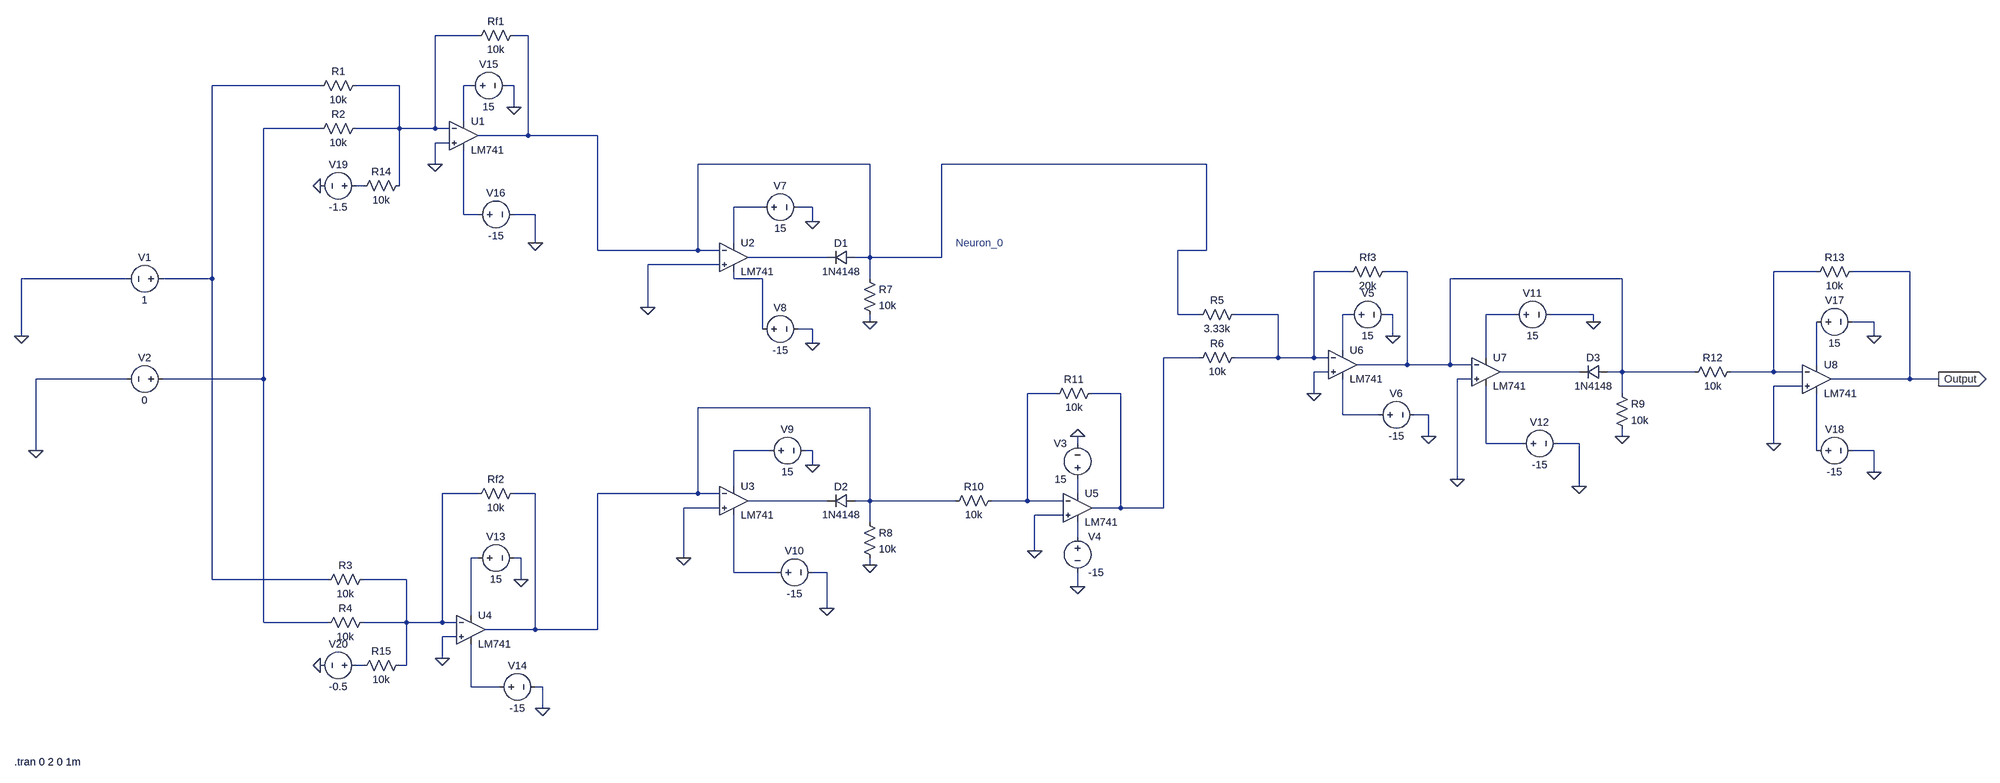
[diagram p0: schematic ANN6.asc]
ANN6.asc, the LTspice schematic file:
Version 4.1
SHEET 1 3404 1012
WIRE -16 -672 -112 -672
WIRE 96 -672 64 -672
WIRE -368 -560 -832 -560
WIRE -192 -560 -288 -560
WIRE -32 -560 -48 -560
WIRE 64 -560 48 -560
WIRE 64 -512 64 -560
WIRE -48 -480 -48 -560
WIRE -368 -464 -640 -464
WIRE -192 -464 -192 -560
WIRE -192 -464 -288 -464
WIRE -112 -464 -112 -672
WIRE -112 -464 -192 -464
WIRE -80 -464 -112 -464
WIRE 96 -448 96 -672
WIRE 96 -448 -16 -448
WIRE 256 -448 96 -448
WIRE -80 -432 -112 -432
WIRE -112 -384 -112 -432
WIRE 864 -384 480 -384
WIRE 1616 -384 1024 -384
WIRE -272 -336 -288 -336
WIRE -192 -336 -192 -464
WIRE 624 -288 560 -288
WIRE 736 -288 704 -288
WIRE -48 -272 -48 -416
WIRE -16 -272 -48 -272
WIRE 112 -272 64 -272
WIRE 736 -256 736 -288
WIRE 112 -208 112 -272
WIRE 560 -208 560 -288
WIRE 256 -192 256 -448
WIRE 480 -192 480 -384
WIRE 480 -192 256 -192
WIRE 528 -192 480 -192
WIRE 1616 -192 1616 -384
WIRE 1616 -192 1552 -192
WIRE 768 -176 592 -176
WIRE 864 -176 864 -384
WIRE 864 -176 832 -176
WIRE 1024 -176 1024 -384
WIRE 1024 -176 864 -176
WIRE 528 -160 368 -160
WIRE 1936 -144 1856 -144
WIRE 2064 -144 2016 -144
WIRE 2992 -144 2896 -144
WIRE 3200 -144 3072 -144
WIRE -1072 -128 -1344 -128
WIRE -832 -128 -832 -560
WIRE -832 -128 -992 -128
WIRE 560 -128 560 -144
WIRE 624 -128 560 -128
WIRE 864 -128 864 -176
WIRE 2544 -128 2160 -128
WIRE 368 -64 368 -160
WIRE 1552 -48 1552 -192
WIRE 1600 -48 1552 -48
WIRE 1776 -48 1680 -48
WIRE 1936 -48 1920 -48
WIRE 2032 -48 2016 -48
WIRE 2304 -48 2240 -48
WIRE 2480 -48 2384 -48
WIRE 864 -32 864 -48
WIRE 2480 -32 2480 -48
WIRE 3120 -32 3072 -32
WIRE 624 -16 624 -128
WIRE 736 -16 704 -16
WIRE -1344 0 -1344 -128
WIRE 2032 0 2032 -48
WIRE 3120 0 3120 -32
WIRE 736 16 736 -16
WIRE 1920 32 1920 -48
WIRE 1600 48 1520 48
WIRE 1776 48 1776 -48
WIRE 1776 48 1680 48
WIRE 1856 48 1856 -144
WIRE 1856 48 1776 48
WIRE 1888 48 1856 48
WIRE 2240 48 2240 -48
WIRE 2064 64 2064 -144
WIRE 2064 64 1952 64
WIRE 2160 64 2160 -128
WIRE 2160 64 2064 64
WIRE 2208 64 2160 64
WIRE 2992 64 2992 -32
WIRE 1888 80 1856 80
WIRE 2448 80 2272 80
WIRE 2544 80 2544 -128
WIRE 2544 80 2512 80
WIRE 2720 80 2544 80
WIRE 2896 80 2896 -144
WIRE 2896 80 2800 80
WIRE 2960 80 2896 80
WIRE -1072 96 -1312 96
WIRE -640 96 -640 -464
WIRE -640 96 -992 96
WIRE 2208 96 2176 96
WIRE 3200 96 3200 -144
WIRE 3200 96 3024 96
WIRE 3264 96 3200 96
WIRE 2960 112 2896 112
WIRE 1280 128 1216 128
WIRE 1424 128 1360 128
WIRE 1856 128 1856 80
WIRE 2544 128 2544 80
WIRE 864 160 480 160
WIRE 1920 176 1920 96
WIRE 2000 176 1920 176
WIRE 2112 176 2080 176
WIRE 2112 224 2112 176
WIRE 2544 224 2544 208
WIRE 1328 240 1328 224
WIRE 2240 240 2240 112
WIRE 2320 240 2240 240
WIRE 2448 240 2400 240
WIRE 2896 240 2896 112
WIRE -1312 256 -1312 96
WIRE 640 256 560 256
WIRE 736 256 720 256
WIRE 2992 256 2992 128
WIRE 3120 256 3072 256
WIRE 736 288 736 256
WIRE 3120 304 3120 256
WIRE 2176 320 2176 96
WIRE 560 336 560 256
WIRE 2448 336 2448 240
WIRE -16 352 -96 352
WIRE 112 352 64 352
WIRE 480 352 480 160
WIRE 480 352 256 352
WIRE 528 352 480 352
WIRE 1328 352 1328 320
WIRE 768 368 592 368
WIRE 864 368 864 160
WIRE 864 368 832 368
WIRE 1056 368 864 368
WIRE 1216 368 1216 128
WIRE 1216 368 1136 368
WIRE 1296 368 1216 368
WIRE 528 384 448 384
WIRE 1424 384 1424 128
WIRE 1424 384 1360 384
WIRE 1520 384 1520 48
WIRE 1520 384 1424 384
WIRE 1296 400 1232 400
WIRE 864 416 864 368
WIRE 1328 448 1328 416
WIRE 1232 480 1232 400
WIRE -16 496 -32 496
WIRE 80 496 64 496
WIRE 448 496 448 384
WIRE 864 512 864 496
WIRE 560 528 560 400
WIRE 656 528 560 528
WIRE 768 528 736 528
WIRE -832 544 -832 -128
WIRE -352 544 -832 544
WIRE -176 544 -272 544
WIRE 80 544 80 496
WIRE 1328 560 1328 528
WIRE 768 608 768 528
WIRE -32 624 -32 496
WIRE -640 640 -640 96
WIRE -352 640 -640 640
WIRE -176 640 -176 544
WIRE -176 640 -272 640
WIRE -96 640 -96 352
WIRE -96 640 -176 640
WIRE -64 640 -96 640
WIRE 112 656 112 352
WIRE 112 656 0 656
WIRE 256 656 256 352
WIRE 256 656 112 656
WIRE -64 672 -96 672
WIRE -96 720 -96 672
WIRE -272 736 -288 736
WIRE -176 736 -176 640
WIRE -176 736 -192 736
WIRE -32 784 -32 688
WIRE 32 784 -32 784
WIRE 128 784 112 784
WIRE 128 832 128 784
FLAG -112 -384 0
FLAG -96 720 0
FLAG 1856 128 0
FLAG 864 -32 0
FLAG 864 512 0
FLAG 2544 224 0
FLAG -1312 256 0
FLAG -1344 0 0
FLAG 2032 0 0
FLAG 2112 224 0
FLAG 736 -256 0
FLAG 768 608 0
FLAG 112 -208 0
FLAG 64 -512 0
FLAG 80 544 0
FLAG 128 832 0
FLAG 736 16 0
FLAG 2448 336 0
FLAG 2480 -32 0
FLAG 368 -64 0
FLAG 448 496 0
FLAG 2176 320 0
FLAG 736 288 0
FLAG 2896 240 0
FLAG 3120 0 0
FLAG 3120 304 0
FLAG 3264 96 Output
IOPIN 3264 96 Out
FLAG -368 -336 0
FLAG -368 736 0
FLAG 1232 480 0
FLAG 1328 224 0
FLAG 1328 560 0
SYMBOL voltage -976 -128 R90
WINDOW 0 -32 56 VBottom 2
WINDOW 3 32 56 VTop 2
WINDOW 123 0 0 Left 0
WINDOW 39 0 0 Left 0
SYMATTR InstName V1
SYMATTR Value 1
SYMBOL voltage -976 96 R90
WINDOW 0 -32 56 VBottom 2
WINDOW 3 32 56 VTop 2
WINDOW 123 0 0 Left 0
WINDOW 39 0 0 Left 0
SYMATTR InstName V2
SYMATTR Value 0
SYMBOL res -272 -576 R90
WINDOW 0 0 56 VBottom 2
WINDOW 3 32 56 VTop 2
SYMATTR InstName R1
SYMATTR Value 10k
SYMBOL res -272 -480 R90
WINDOW 0 0 56 VBottom 2
WINDOW 3 32 56 VTop 2
SYMATTR InstName R2
SYMATTR Value 10k
SYMBOL res 80 -688 R90
WINDOW 0 0 56 VBottom 2
WINDOW 3 32 56 VTop 2
SYMATTR InstName Rf1
SYMATTR Value 10k
SYMBOL res -256 528 R90
WINDOW 0 0 56 VBottom 2
WINDOW 3 32 56 VTop 2
SYMATTR InstName R3
SYMATTR Value 10k
SYMBOL res -256 624 R90
WINDOW 0 0 56 VBottom 2
WINDOW 3 32 56 VTop 2
SYMATTR InstName R4
SYMATTR Value 10k
SYMBOL res 80 336 R90
WINDOW 0 0 56 VBottom 2
WINDOW 3 32 56 VTop 2
SYMATTR InstName Rf2
SYMATTR Value 10k
SYMBOL res 1696 -64 R90
WINDOW 0 0 56 VBottom 2
WINDOW 3 32 56 VTop 2
SYMATTR InstName R5
SYMATTR Value 3.33k
SYMBOL res 1696 32 R90
WINDOW 0 0 56 VBottom 2
WINDOW 3 32 56 VTop 2
SYMATTR InstName R6
SYMATTR Value 10k
SYMBOL res 2032 -160 R90
WINDOW 0 0 56 VBottom 2
WINDOW 3 32 56 VTop 2
SYMATTR InstName Rf3
SYMATTR Value 20k
SYMBOL res 848 -144 R0
SYMATTR InstName R7
SYMATTR Value 10k
SYMBOL diode 832 -192 R90
WINDOW 0 0 32 VBottom 2
WINDOW 3 32 32 VTop 2
SYMATTR InstName D1
SYMATTR Value 1N4148
SYMBOL res 848 400 R0
SYMATTR InstName R8
SYMATTR Value 10k
SYMBOL diode 832 352 R90
WINDOW 0 0 32 VBottom 2
WINDOW 3 32 32 VTop 2
SYMATTR InstName D2
SYMATTR Value 1N4148
SYMBOL res 2528 112 R0
SYMATTR InstName R9
SYMATTR Value 10k
SYMBOL diode 2512 64 R90
WINDOW 0 0 32 VBottom 2
WINDOW 3 32 32 VTop 2
SYMATTR InstName D3
SYMATTR Value 1N4148
SYMBOL voltage 1920 -48 R270
WINDOW 0 32 56 VTop 2
WINDOW 3 -32 56 VBottom 2
WINDOW 123 0 0 Left 0
WINDOW 39 0 0 Left 0
SYMATTR InstName V5
SYMATTR Value 15
SYMBOL voltage 1984 176 R270
WINDOW 0 32 56 VTop 2
WINDOW 3 -32 56 VBottom 2
WINDOW 123 0 0 Left 0
WINDOW 39 0 0 Left 0
SYMATTR InstName V6
SYMATTR Value -15
SYMBOL voltage 608 -288 R270
WINDOW 0 32 56 VTop 2
WINDOW 3 -32 56 VBottom 2
WINDOW 123 0 0 Left 0
WINDOW 39 0 0 Left 0
SYMATTR InstName V7
SYMATTR Value 15
SYMBOL voltage 608 -16 R270
WINDOW 0 32 56 VTop 2
WINDOW 3 -32 56 VBottom 2
WINDOW 123 0 0 Left 0
WINDOW 39 0 0 Left 0
SYMATTR InstName V8
SYMATTR Value -15
SYMBOL voltage 624 256 R270
WINDOW 0 32 56 VTop 2
WINDOW 3 -32 56 VBottom 2
WINDOW 123 0 0 Left 0
WINDOW 39 0 0 Left 0
SYMATTR InstName V9
SYMATTR Value 15
SYMBOL voltage 640 528 R270
WINDOW 0 32 56 VTop 2
WINDOW 3 -32 56 VBottom 2
WINDOW 123 0 0 Left 0
WINDOW 39 0 0 Left 0
SYMATTR InstName V10
SYMATTR Value -15
SYMBOL voltage 2288 -48 R270
WINDOW 0 32 56 VTop 2
WINDOW 3 -32 56 VBottom 2
WINDOW 123 0 0 Left 0
WINDOW 39 0 0 Left 0
SYMATTR InstName V11
SYMATTR Value 15
SYMBOL voltage 2304 240 R270
WINDOW 0 32 56 VTop 2
WINDOW 3 -32 56 VBottom 2
WINDOW 123 0 0 Left 0
WINDOW 39 0 0 Left 0
SYMATTR InstName V12
SYMATTR Value -15
SYMBOL voltage -32 496 R270
WINDOW 0 32 56 VTop 2
WINDOW 3 -32 56 VBottom 2
WINDOW 123 0 0 Left 0
WINDOW 39 0 0 Left 0
SYMATTR InstName V13
SYMATTR Value 15
SYMBOL voltage 16 784 R270
WINDOW 0 32 56 VTop 2
WINDOW 3 -32 56 VBottom 2
WINDOW 123 0 0 Left 0
WINDOW 39 0 0 Left 0
SYMATTR InstName V14
SYMATTR Value -15
SYMBOL voltage -48 -560 R270
WINDOW 0 32 56 VTop 2
WINDOW 3 -32 56 VBottom 2
WINDOW 123 0 0 Left 0
WINDOW 39 0 0 Left 0
SYMATTR InstName V15
SYMATTR Value 15
SYMBOL voltage -32 -272 R270
WINDOW 0 32 56 VTop 2
WINDOW 3 -32 56 VBottom 2
SYMATTR InstName V16
SYMATTR Value -15
SYMBOL voltage 2976 -32 R270
WINDOW 0 32 56 VTop 2
WINDOW 3 -32 56 VBottom 2
WINDOW 123 0 0 Left 0
WINDOW 39 0 0 Left 0
SYMATTR InstName V17
SYMATTR Value 15
SYMBOL voltage 2976 256 R270
WINDOW 0 32 56 VTop 2
WINDOW 3 -32 56 VBottom 2
WINDOW 123 0 0 Left 0
WINDOW 39 0 0 Left 0
SYMATTR InstName V18
SYMATTR Value -15
SYMBOL res 3088 -160 R90
WINDOW 0 0 56 VBottom 2
WINDOW 3 32 56 VTop 2
SYMATTR InstName R13
SYMATTR Value 10k
SYMBOL res 2816 64 R90
WINDOW 0 0 56 VBottom 2
WINDOW 3 32 56 VTop 2
SYMATTR InstName R12
SYMATTR Value 10k
SYMBOL LM741 -48 -512 R0
SYMATTR InstName U1
SYMBOL LM741 560 -240 R0
SYMATTR InstName U2
SYMBOL LM741 560 304 R0
SYMATTR InstName U3
SYMBOL LM741 -32 592 R0
SYMATTR InstName U4
SYMBOL LM741 1920 0 R0
SYMATTR InstName U6
SYMBOL LM741 2240 16 R0
SYMATTR InstName U7
SYMBOL LM741 2992 32 R0
SYMATTR InstName U8
SYMBOL voltage -272 -336 R90
WINDOW 0 -32 56 VBottom 2
WINDOW 3 32 56 VTop 2
SYMATTR InstName V19
SYMATTR Value -1.5
SYMBOL voltage -272 736 R90
WINDOW 0 -32 56 VBottom 2
WINDOW 3 32 56 VTop 2
SYMATTR InstName V20
SYMATTR Value -0.5
SYMBOL res -176 -352 R90
WINDOW 0 0 56 VBottom 2
WINDOW 3 32 56 VTop 2
SYMATTR InstName R14
SYMATTR Value 10k
SYMBOL res -176 720 R90
WINDOW 0 0 56 VBottom 2
WINDOW 3 32 56 VTop 2
SYMATTR InstName R15
SYMATTR Value 10k
SYMBOL LM741 1328 320 R0
SYMATTR InstName U5
SYMBOL res 1152 352 R90
WINDOW 0 0 56 VBottom 2
WINDOW 3 32 56 VTop 2
SYMATTR InstName R10
SYMATTR Value 10k
SYMBOL voltage 1328 336 R180
WINDOW 0 24 96 Left 2
WINDOW 3 24 16 Left 2
SYMATTR InstName V3
SYMATTR Value 15
SYMBOL voltage 1328 432 R0
SYMATTR InstName V4
SYMATTR Value -15
SYMBOL res 1376 112 R90
WINDOW 0 0 56 VBottom 2
WINDOW 3 32 56 VTop 2
SYMATTR InstName R11
SYMATTR Value 10k
TEXT 1056 -208 Left 2 ;Neuron_0
TEXT -1360 952 Left 2 !.tran 0 2 0 1m

The netlist it stands for:
* ANN6.asc
V1 N003 0 1
V2 N005 0 0
R1 N001 N003 10k
R2 N001 N005 10k
Rf1 N002 N001 10k
R3 N025 N003 10k
R4 N025 N005 10k
Rf2 N020 N025 10k
R5 N010 N002 3.33k
R6 N010 N016 10k
Rf3 N011 N010 20k
R7 N002 0 10k
D1 N002 N009 1N4148
R8 N020 0 10k
D2 N020 N027 1N4148
R9 N011 0 10k
D3 N011 N018 1N4148
V5 N014 0 15
V6 N021 0 -15
V7 N007 0 15
V8 N013 0 -15
V9 N023 0 15
V10 N030 0 -15
V11 N015 0 15
V12 N022 0 -15
V13 N029 0 15
V14 N032 0 -15
V15 N004 0 15
V16 N008 0 -15
V17 N017 0 15
V18 N024 0 -15
R13 Output N012 10k
R12 N012 N011 10k
X§U1 0 N001 N004 N008 N002 LM741  ; pins In+ In- V+ V- OUT
X§U2 0 N002 N007 N013 N009 LM741  ; pins In+ In- V+ V- OUT
X§U3 0 N020 N023 N030 N027 LM741  ; pins In+ In- V+ V- OUT
X§U4 0 N025 N029 N032 N020 LM741  ; pins In+ In- V+ V- OUT
X§U6 0 N010 N014 N021 N011 LM741  ; pins In+ In- V+ V- OUT
X§U7 0 N011 N015 N022 N018 LM741  ; pins In+ In- V+ V- OUT
X§U8 0 N012 N017 N024 Output LM741  ; pins In+ In- V+ V- OUT
V19 N006 0 -1.5
V20 N031 0 -0.5
R14 N001 N006 10k
R15 N025 N031 10k
X§U5 0 N019 N026 N028 N016 LM741  ; pins In+ In- V+ V- OUT
R10 N019 N020 10k
V3 N026 0 15
V4 N028 0 -15
R11 N016 N019 10k
.model D D
.lib standard.dio
* Neuron_0
.tran 0 2 0 1m
.lib LM741.lib
.backanno
.end